# EAGLE schematic placa (EAGLE 5.01)
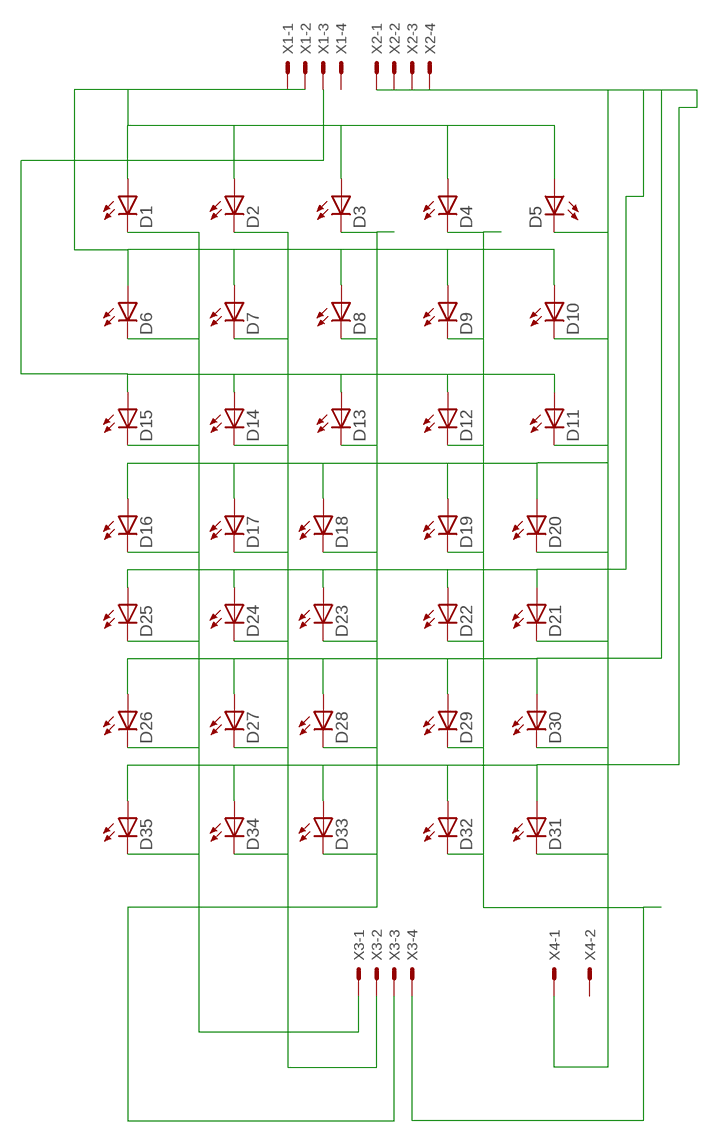
[diagram p0: schematic, sheet 1]

## Parts
D1  LED5MM  [LED5MM]
D2  LED5MM  [LED5MM]
D3  LED5MM  [LED5MM]
D4  LED5MM  [LED5MM]
D5  LED5MM  [LED5MM]
D6  LED5MM  [LED5MM]
D7  LED5MM  [LED5MM]
D8  LED5MM  [LED5MM]
D9  LED5MM  [LED5MM]
D10  LED5MM  [LED5MM]
D11  LED5MM  [LED5MM]
D12  LED5MM  [LED5MM]
D13  LED5MM  [LED5MM]
D14  LED5MM  [LED5MM]
D15  LED5MM  [LED5MM]
D16  LED5MM  [LED5MM]
D17  LED5MM  [LED5MM]
D18  LED5MM  [LED5MM]
D19  LED5MM  [LED5MM]
D20  LED5MM  [LED5MM]
D21  LED5MM  [LED5MM]
D22  LED5MM  [LED5MM]
D23  LED5MM  [LED5MM]
D24  LED5MM  [LED5MM]
D25  LED5MM  [LED5MM]
D26  LED5MM  [LED5MM]
D27  LED5MM  [LED5MM]
D28  LED5MM  [LED5MM]
D29  LED5MM  [LED5MM]
D30  LED5MM  [LED5MM]
D31  LED5MM  [LED5MM]
D32  LED5MM  [LED5MM]
D33  LED5MM  [LED5MM]
D34  LED5MM  [LED5MM]
D35  LED5MM  [LED5MM]
X1  KK-156-4  [KK-156-4]
X2  KK-156-4  [KK-156-4]
X3  KK-156-4  [KK-156-4]
X4  KK-156-2  [KK-156-2]

## Nets
N$1: D1.A D2.A D3.A D4.A D5.A X1.1
N$2: D6.A D7.A D8.A D9.A D10.A X1.2
N$3: D16.A D17.A D18.A D19.A D20.A X2.1
N$4: D11.A D12.A D13.A D14.A D15.A X1.3
N$5: D21.A D22.A D23.A D24.A D25.A X2.2
N$6: D26.A D27.A D28.A D29.A D30.A X2.3
N$7: D31.A D32.A D33.A D34.A D35.A X2.4
N$12: D1.K(C) D6.K(C) D15.K(C) D16.K(C) D25.K(C) D26.K(C) D35.K(C) X3.1
N$13: D2.K(C) D7.K(C) D14.K(C) D17.K(C) D24.K(C) D27.K(C) D34.K(C) X3.2
N$14: D3.K(C) D8.K(C) D13.K(C) D18.K(C) D23.K(C) D28.K(C) D33.K(C) X3.3
N$15: D4.K(C) D9.K(C) D12.K(C) D19.K(C) D22.K(C) D29.K(C) D32.K(C) X3.4
N$16: D5.K(C) D10.K(C) D11.K(C) D20.K(C) D21.K(C) D30.K(C) D31.K(C) X4.1
Unconnected: X1.4 X4.2

## Library data of the parts
D1-D35 = led:LED: LED OSRAM: - CHIPLED LG R971, LG N971, LY N971, LG Q971, LY Q971, LO R971, LY R971 LH N974, LH R974 LS Q976, LO Q976, LY Q976 LO Q996 - Hyper CHIPLED LW Q18S LB Q993, LB Q99A, LB R99A - SideLED LS A670, LO A670, LY A670, LG A670, LP A670 LB A673, LV A673, LT A673, LW A673 LH A674 LY A675 LS A676, LA A676, LO A676, LY A676, LW A676 LS A679, LY A679, LG A679 - Hyper Micro SIDELED® LS Y876, LA Y876, LO Y876, LY Y876 LT Y87S - SmartLED LW L88C, LW L88S LB L89C, LB L89S, LG L890 LS L89K, LO L89K, LY L89K LS L896, LA L896, LO L896, LY L896 - TOPLED LS T670, LO T670, LY T670, LG T670, LP T670 LSG T670, LSP T670, LSY T670, LOP T670, LYG T670 LG T671, LOG T671, LSG T671 LB T673, LV T673, LT T673, LW T673 LH T674 LS T676, LA T676, LO T676, LY T676, LB T676, LH T676, LSB T676, LW T676 LB T67C, LV T67C, LT T67C, LS T67K, LO T67K, LY T67K, LW E67C LS E67B, LA E67B, LO E67B, LY E67B, LB E67C, LV E67C, LT E67C LW T67C LS T679, LY T679, LG T679 LS T770, LO T770, LY T770, LG T770, LP T770 LB T773, LV T773, LT T773, LW T773 LH T774 LS E675, LA E675, LY E675, LS T675 LS T776, LA T776, LO T776, LY T776, LB T776 LHGB T686 LT T68C, LB T68C - Hyper Mini TOPLED® LB M676 - Mini TOPLED Santana® LG M470 LS M47K, LO M47K, LY M47K Source: http://www.osram.convergy.de - LUMILED® LXK2-PW12-R00, LXK2-PW12-S00, LXK2-PW14-U00, LXK2-PW14-V00 LXK2-PM12-R00, LXK2-PM12-S00, LXK2-PM14-U00 LXK2-PE12-Q00, LXK2-PE12-R00, LXK2-PE12-S00, LXK2-PE14-T00, LXK2-PE14-U00 LXK2-PB12-K00, LXK2-PB12-L00, LXK2-PB12-M00, LXK2-PB14-N00, LXK2-PB14-P00, LXK2-PB14-Q00 LXK2-PR12-L00, LXK2-PR12-M00, LXK2-PR14-Q00, LXK2-PR14-R00 LXK2-PD12-Q00, LXK2-PD12-R00, LXK2-PD12-S00 LXK2-PH12-R00, LXK2-PH12-S00 LXK2-PL12-P00, LXK2-PL12-Q00, LXK2-PL12-R00 Source: www.luxeon.com
X1-X3 = con-molex:KK-156-4: KK 156 HEADER Source: http://www.molex.com/pdm_docs/sd/026604100_sd.pdf
X4 = con-molex:KK-156-2: KK 156 HEADER Source: http://www.molex.com/pdm_docs/sd/026604100_sd.pdf